# EAGLE design Pointcast_lower_board_V1.02 (EAGLE 7.5.0)
DESIGNER: Rob Oudendijk; VERSION: V1.02
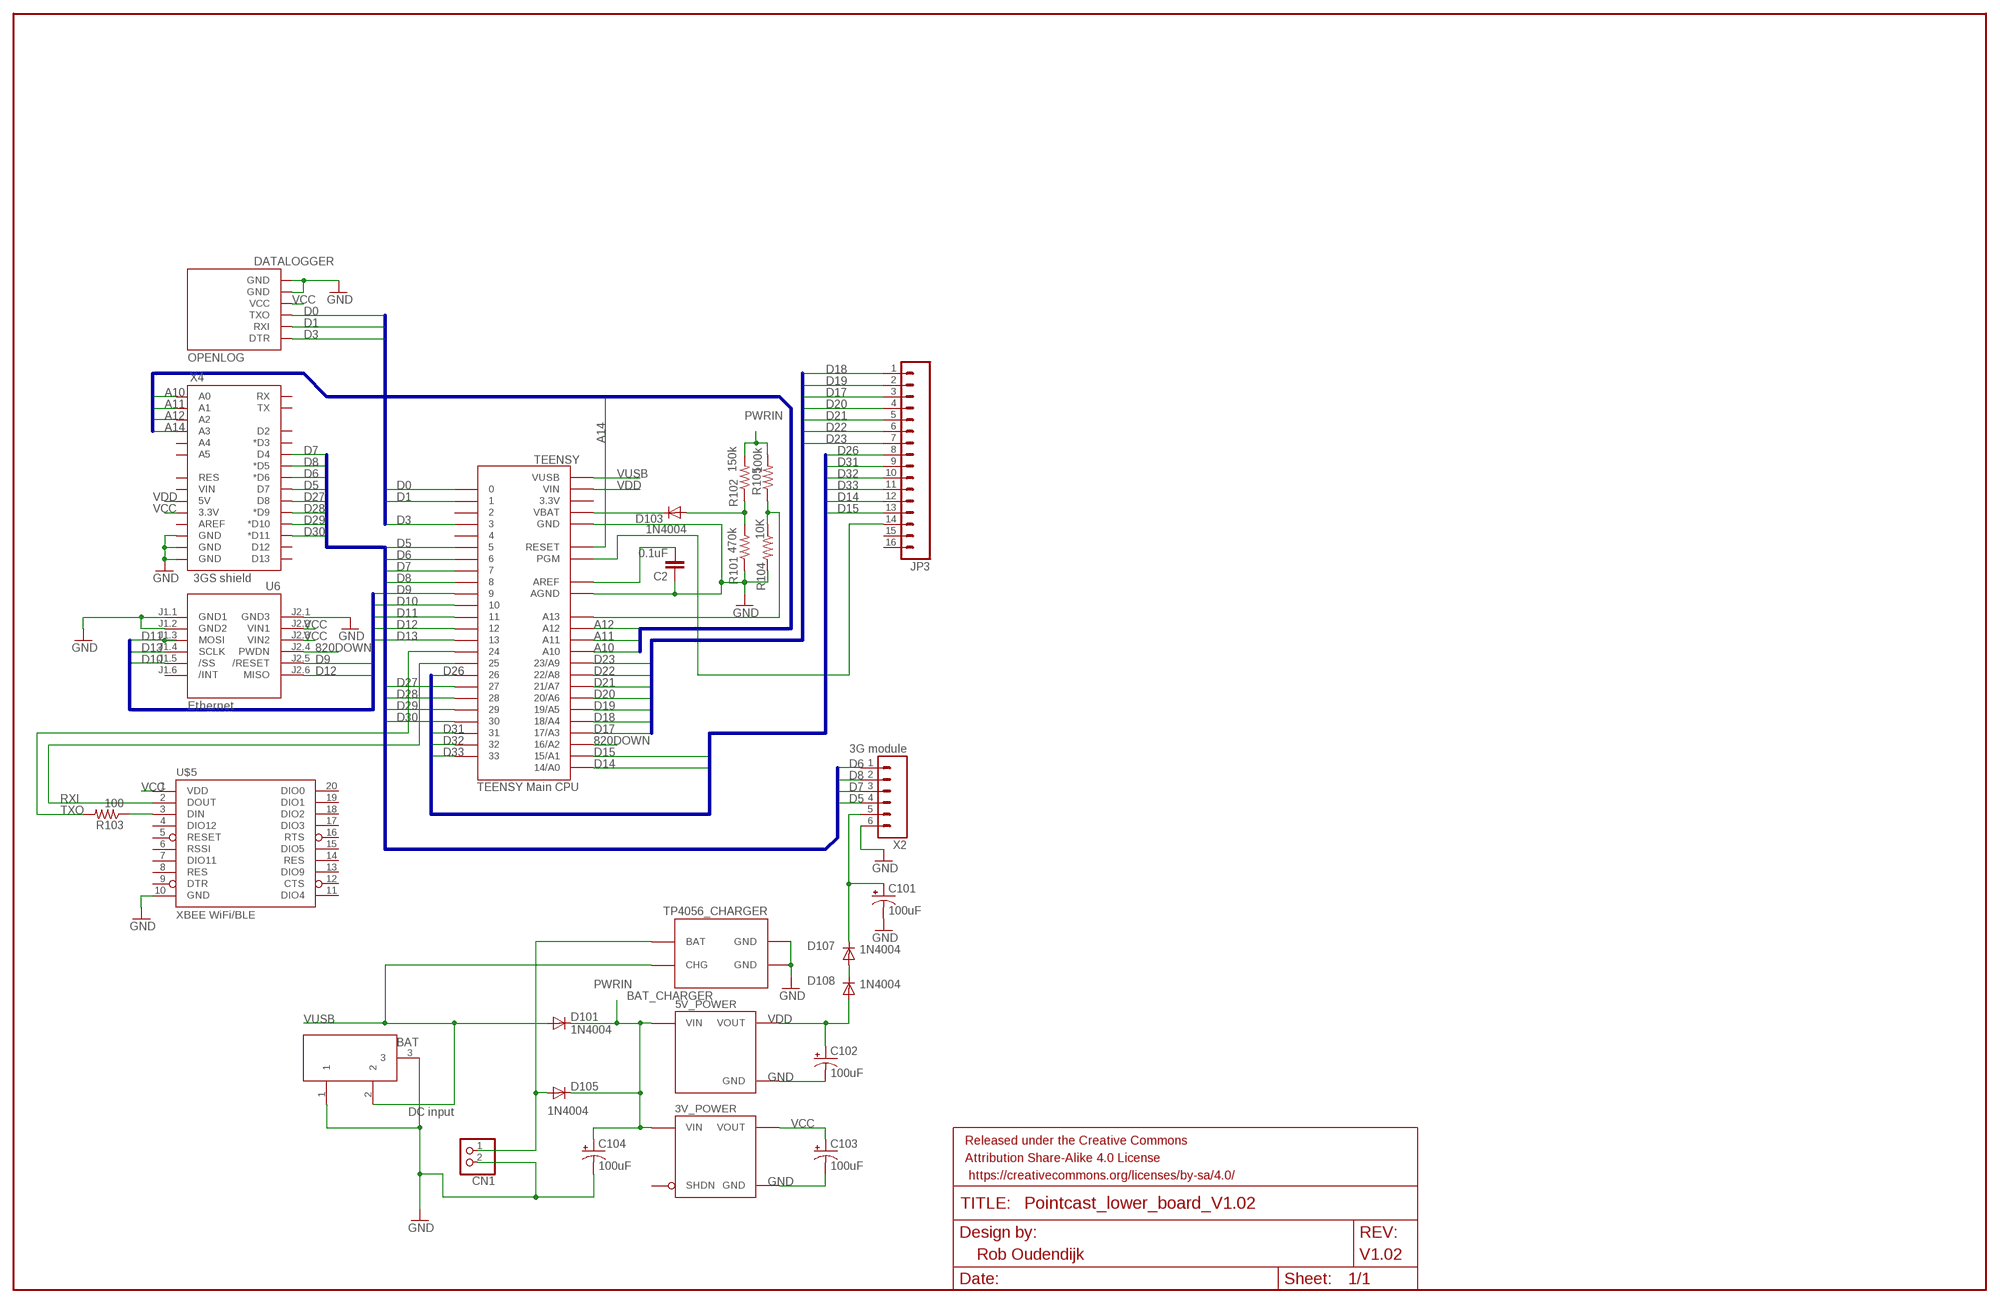
[diagram p0: schematic, sheet 1]

## Parts
3V_POWER  POLOLU_D24V3AXV  [POLOLU_D24VXAYV_HC]
5V_POWER  POLOLU_S7V8F5  [POLOLU_S7V8F5]
BAT_CHARGER  TP4056_CHARGER  [TP4056]
C2  0.1uF  C-EU025-024X044  [C025-024X044]
C101  100uF  CAP_POLPTH1  [CPOL-RADIAL-100UF-25V]
C102  100uF  CAP_POLPTH1  [CPOL-RADIAL-100UF-25V]
C103  100uF  CAP_POLPTH1  [CPOL-RADIAL-100UF-25V]
C104  100uF  CAP_POLPTH1  [CPOL-RADIAL-100UF-25V]
CN1  JST_2PIN-THM-RA  [JST-PH-2-THM-RA]
D101  1N4004  [DO41-10]
D103  1N4004  [DO41-10]
D105  1N4004  [DO41-10]
D107  1N4004  [DO41-10]
D108  1N4004  [DO41-10]
DATALOGGER  OPENLOG  [OPENLOG]
DCINPUT  5Volt  DC21MMX  [DC-21MM]
FRAME1  FRAME-LEDGER  [CREATIVE_COMMONS]
JP3  M16PTH  [1X16]
R101  470k  R-US_0207/10  [0207/10]
R102  150k  R-US_0207/10  [0207/10]
R103  100  R-US_0207/10  [0207/10]
R104  10K  R-US_0207/10  [0207/10]
R105  100k  R-US_0207/10  [0207/10]
TEENSY  TEENSY Main CPU  TEENSY_3.0_ALLPINS  [TEENSY_3.0_ALLPINS]
U6  Ethernet  WIZ820IO_DEVICE'DUAL-IN-LINE'  [WIZ820IO]
U$5  XBEE WiFi/BLE  XBEE-2B2  [XBEE-SILK]
X2  3G module  M06SILK_FEMALE_PTH  [1X06]
X4  3GS shield  ARDUINO_SHIELDLABEL  [DUEMILANOVE_SHIELD]

## Nets
820DOWN: TEENSY.16/A2 U6.J2.4(PWDN)
A10: TEENSY.A10 X4.A0
A11: TEENSY.A11 X4.A1
A12: TEENSY.A12 X4.A2
A14: TEENSY.RESET X4.A3
BAT [VDD]: BAT_CHARGER.BAT CN1.1 D105.A
D0: DATALOGGER.JP1$3(TXO) TEENSY.0
D1: DATALOGGER.JP1$2(RXI) TEENSY.1
D3: DATALOGGER.JP1$1(DTR) TEENSY.3
D5: TEENSY.5 X2.4 X4.D7
D6: TEENSY.6 X2.1 X4.D6(*D6)
D7: TEENSY.7 X2.3 X4.D4
D8: TEENSY.8 X2.2 X4.D5(*D5)
D9: TEENSY.9 U6.J2.5(/RESET)
D10: TEENSY.10 U6.J1.5(/SS)
D11: TEENSY.11 U6.J1.3(MOSI)
D12: TEENSY.12 U6.J2.6(MISO)
D13: TEENSY.13 U6.J1.4(SCLK)
D14: JP3.12 TEENSY.14/A0
D15: JP3.13 TEENSY.15/A1
D17: JP3.3 TEENSY.17/A3
D18: JP3.1 TEENSY.18/A4
D19: JP3.2 TEENSY.19/A5
D20: JP3.4 TEENSY.20/A6
D21: JP3.5 TEENSY.21/A7
D22: JP3.6 TEENSY.22/A8
D23: JP3.7 TEENSY.23/A9
D26: JP3.8 TEENSY.26
D27: TEENSY.27 X4.D8
D28: TEENSY.28 X4.D9(*D9)
D29: TEENSY.29 X4.D10(*D10)
D30: TEENSY.30 X4.D11(*D11)
D31: JP3.9 TEENSY.31
D32: JP3.10 TEENSY.32
D33: JP3.11 TEENSY.33
GND [VCC]: 3V_POWER.G(GND) 5V_POWER.G(GND) BAT_CHARGER.GND BAT_CHARGER.GND2(GND) C2.1 C101.1(-) C102.1(-) C103.1(-) C104.1(-) CN1.2 DATALOGGER.JP1$5(GND) DATALOGGER.JP1$6(GND) DCINPUT.1 DCINPUT.3 R101.1 R104.2 TEENSY.AGND TEENSY.GND TEENSY.GND1(GND) TEENSY.GND2(GND) U6.J1.1(GND1) U6.J1.2(GND2) U6.J2.1(GND3) U$5.10(GND) X2.6 X4.GND@0(GND) X4.GND@1(GND) X4.GND@2(GND)
N$1: D103.C TEENSY.VBAT
N$2: D103.A R101.2 R102.1
N$8: R104.1 R105.1 TEENSY.A13
N$10: R103.1 U$5.3(DIN)
N$21: C2.2 TEENSY.AREF
N$22: JP3.14 TEENSY.PGM
N$31 [VCC]: D107.A D108.C
N$32 [VCC]: C101.2(+) D107.C X2.5
PWRIN [VDD]: 3V_POWER.I(VIN) 5V_POWER.I(VIN) C104.2(+) D101.C D105.C R102.2 R105.2
RXI: TEENSY.25 U$5.2(DOUT)
TXO: R103.2 TEENSY.24
VCC [VCC]: 3V_POWER.O(VOUT) C103.2(+) DATALOGGER.JP1$4(VCC) U6.J2.2(VIN1) U6.J2.3(VIN2) U$5.1(VDD) X4.3.3V
VDD [VDD]: 5V_POWER.O(VOUT) C102.2(+) D108.A TEENSY.VIN X4.5V
VUSB [VDD]: BAT_CHARGER.CHARGER(CHG) D101.A DCINPUT.2 TEENSY.VUSB
Unconnected: 3V_POWER.S(SHDN) JP3.15 JP3.16 TEENSY.2 TEENSY.3.3V TEENSY.3.3V1(3.3V) TEENSY.3.3V2(3.3V) TEENSY.4 U6.J1.6(/INT) U$5.4(DIO12) U$5.5(RESET) U$5.6(RSSI) U$5.7(DIO11) U$5.8(RES) U$5.9(DTR) U$5.11(DIO4) U$5.12(CTS) U$5.13(DIO9) U$5.14(RES) U$5.15(DIO5) U$5.16(RTS) U$5.17(DIO3) U$5.18(DIO2) U$5.19(DIO1) U$5.20(DIO0) X4.A4 X4.A5 X4.AREF X4.D2 X4.D3(*D3) X4.D12 X4.D13 X4.RES X4.RX X4.TX X4.VIN

## Buses
D[17..23]
D[9..13]
D[0..3]
D[5..30]
A[10..14]
D[14..33]

## Notes on the sheet
- DC input

## Library data of the parts
3V_POWER = Pololu:POLOLU_D24V3A*V: Pololu Adjustable Step Down Voltage Regulators Series D24V3A_V (300 mA) 0.4"x0.6" SOURCE www.pololu.com/ PACKAGE THT; 4-pin (0.1"); 0.4"x0.6" TECHNOLOGIES D24V3A…V Vi = (4.5…42)V Vo/V (Vo < Vi) X: (generic) L: (2.5… 7.5) H: (4.0…25.0) Io: 300 mA; Quiescent Current: 2 mA (SHDN: 20 uA) Author: Dipl.-Ing. FH Rainer Bayer
5V_POWER = POLOLU1:POLOLU_S7V8F5: POLOLU_S7V8F5
BAT_CHARGER = open_hw_sockets:TP4056_CHARGER: TP4056
C2 = rcl:C-EU: CAPACITOR, European symbol
C101-C104 = SparkFun-Capacitors:CAP_POL: Capacitor Polarized These are standard SMD and PTH capacitors. Normally 10uF, 47uF, and 100uF in electrolytic and tantalum varieties. Always verify the external diameter of the through hole cap, it varies with capacity, voltage, and manufacturer. The EIA devices should be standard.
CN1 = adafruit:JST_2PIN: JST 2-Pin Connectors of various flavors SMT-RA (S2B-PH-SM4) 4UConnector #17311 SMT (B2B-PH-SM4) THM-RA (S2B-PH) THM (B2B-PH)
D101 D103 D105 D107 D108 = adafruit:1N4004: DIODE General purpose 1N400x type rectifier (With bigger pads) http://www.ladyada.net/library/pcb/eaglelibrary.html
DATALOGGER = open_hw_sockets:OPENLOG: Openlog
DCINPUT = powersupply:DC21MM
FRAME1 = SparkFun-Aesthetics:FRAME-LEDGER: Schematic Frame Standard 11x14 US Ledger frame
JP3 = SparkFun-Connectors:M16: 1x16 .1" header
R101-R105 = adafruit:R-US_: RESISTOR, American symbol
TEENSY = Teensy3.0:TEENSY_3.0_ALLPINS: Teensy 3.0 with all pin holes and optional SMD-mount unshrouded header on bottom of Teensy 3.0. For more basic versions, see 'Basic', '+4' and 'AllAnalogPins'. Requires the installation of a un-shrouded SMD header on the underside of the Teensy 3.0
U6 = Wiz820io:WIZ820IO_DEVICE: WIZnet, WIZ820io plug in module incl. W5200 chip and MagJack
U$5 = SparkFun-RF:XBEE-2: Xbee module footprints SMT header is CONN-09042.
X2 = SparkFun-Connectors:M06: Header 6 Standard 6-pin 0.1" header. Use with straight break away headers (SKU : PRT-00116), right angle break away headers (PRT-00553), swiss pins (PRT-00743), machine pins (PRT-00117), and female headers (PRT-00115). Molex polarized connector foot print use with SKU : PRT-08094 with associated crimp pins and housings. NOTES ON THE VARIANTS LOCK and LOCK_LONGPADS... This footprint was designed to help hold the alignment of a through-hole component (i.e. 6-pin header) while soldering it into place. You may notice that each hole has been shifted either up or down by 0.005 of an inch from it's more standard position (which is a perfectly straight line). This slight alteration caused the pins (the squares in the middle) to touch the edges of the holes. Because they are alternating, it causes a "brace" to hold the component in place. 0.005 has proven to be the perfect amount of "off-center" position when using our standard breakaway headers. Although looks a little odd when you look at the bare footprint, once you have a header in there, the alteration is very hard to notice. Also,if you push a header all the way into place, it is covered up entirely on the bottom side. This idea of altering the position of holes to aid alignment will be further integrated into the Sparkfun Library for other footprints. It can help hold any component with 3 or more connection pins.; PROD_ID: CONN-08437
X4 = SparkFun-Boards:ARDUINO_SHIELD: Arduino shield footprint

## Net classes
0 default: width 0.406 mm, drill 0.254 mm, clearance 0.305 mm
1 VCC: width 0.7 mm, drill 0.254 mm, clearance 0.305 mm to class 0, clearance 0.205 mm
2 GND: width 0.7 mm, drill 0.254 mm, clearance 0.305 mm to class 0, clearance 0.205 mm to class 1
3 VDD: width 0.7 mm, drill 0.254 mm, clearance 0.305 mm to class 0, clearance 0.205 mm to class 1

## Board
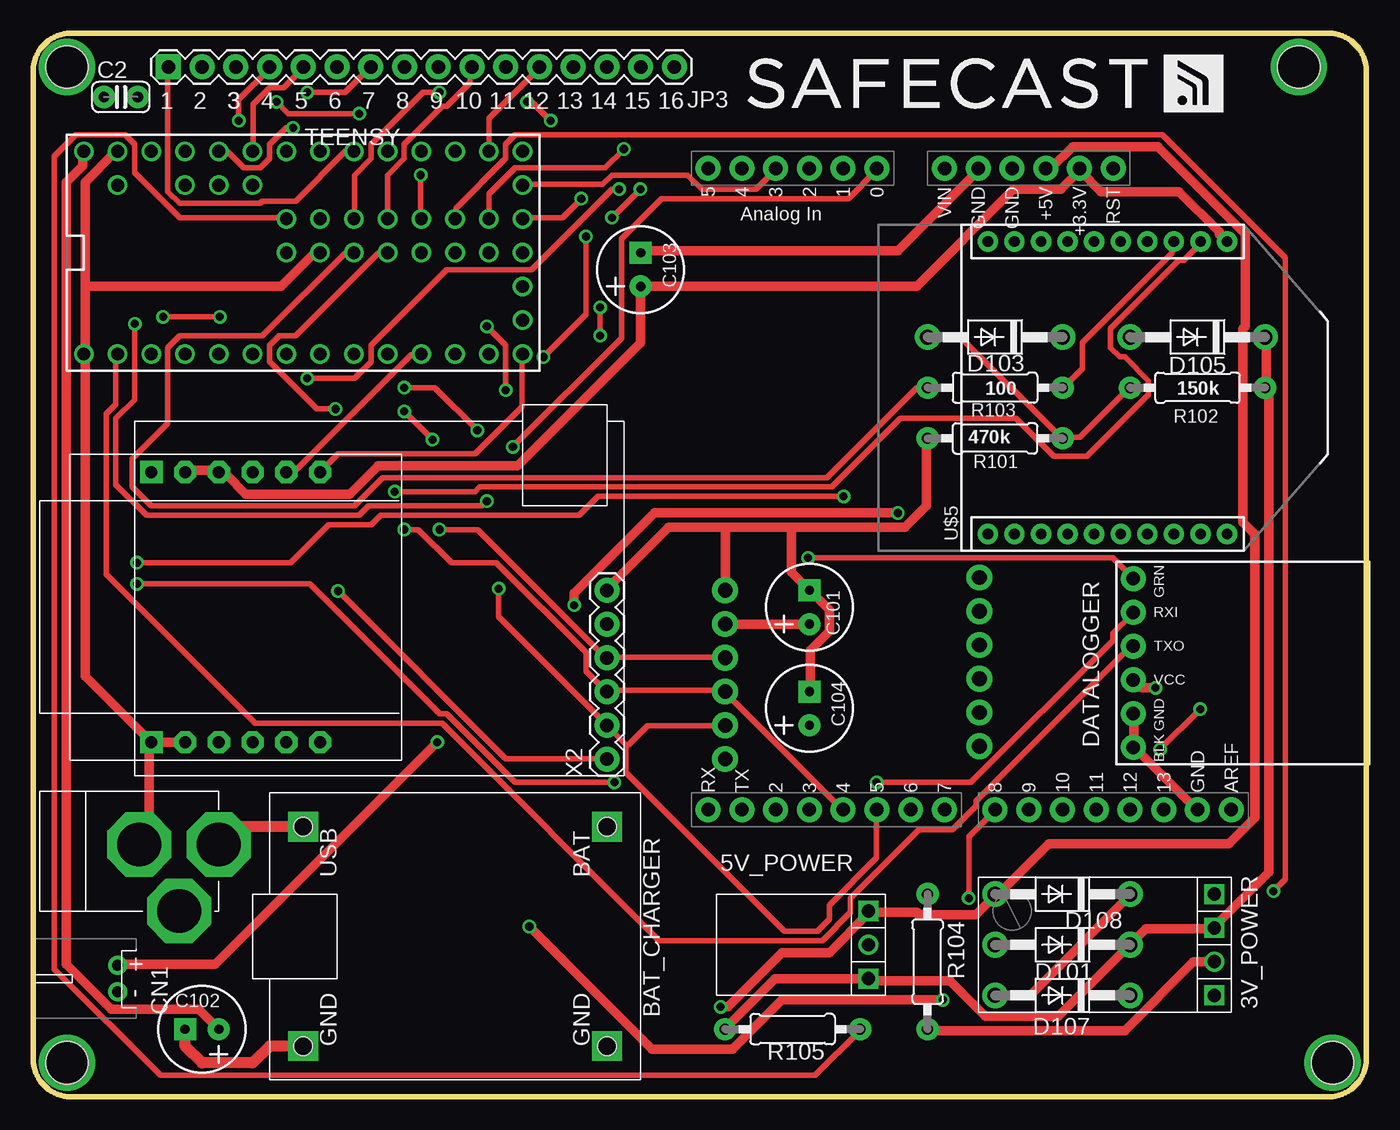
[diagram p1: board, top side]
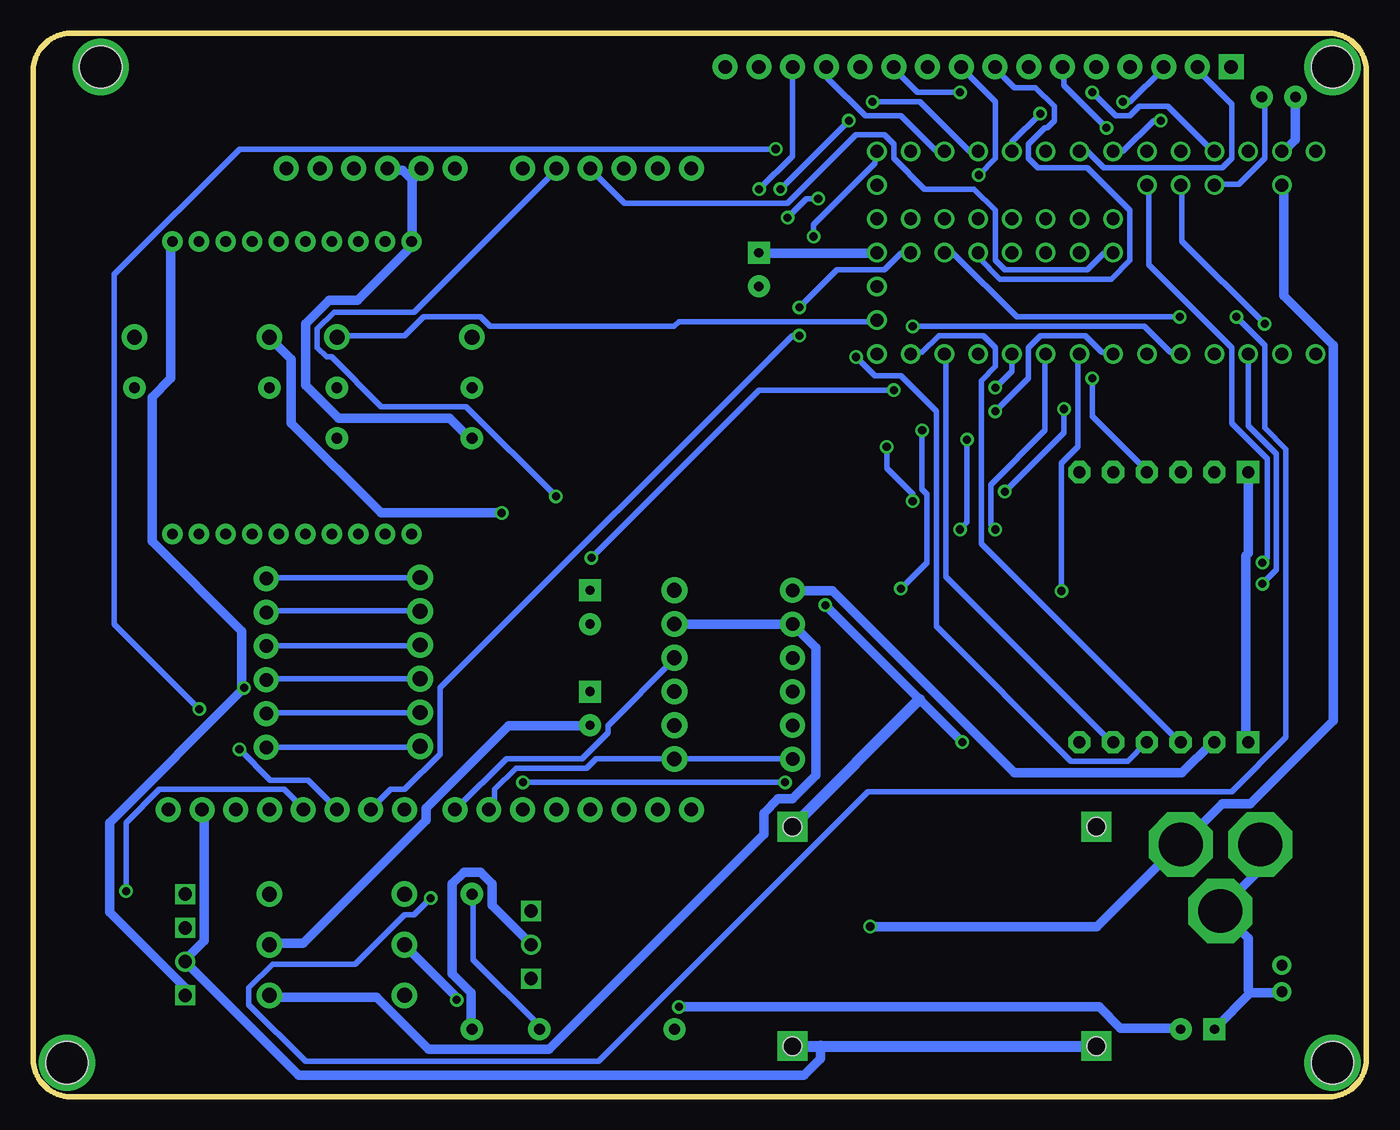
[diagram p2: board, bottom side, seen from below]

Size 100.33 x 80.01 mm. Coordinates in mm from the lower left corner, seen from the top.
Outline: 97.49,0 2.84,0 arc-90 0,2.84 0,77.17 arc-90 2.84,80.01 97.49,80.01 arc-90 100.33,77.17 100.33,2.84 arc-90 97.49,0
Copper layers (1*16): Top 0.035mm / dielectric 1.5mm / Bottom 0.035mm
Design rules "default": minimum track width 10mil, minimum drill 24mil, track to track 8mil, track to pad 8mil, pad to pad 8mil, via to via 8mil, smd to smd 8mil, copper to edge 40mil, drill to drill 8mil, minimum pad ring 10mil, minimum via ring 8mil, stop-mask expansion 4mil, vias tented up to drill 0mil, thermal gap 10mil
Holes 3.2 mm at 95.25,77.47 97.79,2.54 2.54,2.54 2.54,77.47

### Footprints (pad centres in the part's own frame; a part is rotated, then mirrored left to right if it is on the bottom)
POLOLU_D24VXAYV_HC = drill 1: G -1.27,-8.89 | drill 1 square: I 1.27,-8.89; O -3.81,-8.89; S 3.81,-8.89
POLOLU_S7V8F5 = drill 1: G 0,-5.715 | drill 1 square: I -2.54,-5.715; O 2.54,-5.715
TP4056 = drill 1.5 square: BAT 7.62,-12.7; CHARGER 7.62,10.16; GND -8.89,10.16; GND2 -8.89,-12.7 | hole 1.4: -8.89,10.16; 7.62,10.16; 7.62,-12.7; -8.89,-12.7
C025-024X044 = drill 0.813 pad 1.676: 1 -1.27,0; 2 1.27,0
CPOL-RADIAL-100UF-25V = drill 0.7 pad 1.651 square: 1 -1.27,0 | drill 0.7 pad 1.651: 2 1.27,0
JST-PH-2-THM-RA = drill 0.8 pad 1.422: 1 1,0; 2 -1,0
DO41-10 = drill 1.118 pad 1.93: A 5.08,0; C -5.08,0
OPENLOG = drill 1.016 pad 1.88: JP1$1 1.27,1.27; JP1$2 3.81,1.27; JP1$3 6.35,1.27; JP1$4 8.89,1.27; JP1$5 11.43,1.27; JP1$6 13.97,1.27
DC-21MM = drill 3.302 pad 4.826 octagon: 1 -5.08,-3.353; 2 -0.076,-6.35; 3 -0.076,-0.356
1X16 = drill 1.016 pad 1.88 square: 1 0,0 | drill 1.016 pad 1.88: 2 2.54,0; 3 5.08,0; 4 7.62,0; 5 10.16,0; 6 12.7,0; 7 15.24,0; 8 17.78,0; 9 20.32,0; 10 22.86,0; 11 25.4,0; 12 27.94,0; 13 30.48,0; 14 33.02,0; 15 35.56,0; 16 38.1,0
0207/10 = drill 0.813 pad 1.676: 1 -5.08,0; 2 5.08,0
TEENSY_3.0_ALLPINS = drill 0.965: 0 -7.62,13.97; 1 -7.62,11.43; 2 -7.62,8.89; 3 -7.62,6.35; 3.3V 7.62,11.43; 3.3V1 -2.54,-16.51; 3.3V2 2.54,-1.27; 4 -7.62,3.81; 5 -7.62,1.27; 6 -7.62,-1.27; 7 -7.62,-3.81; 8 -7.62,-6.35; 9 -7.62,-8.89; 10 -7.62,-11.43; 11 -7.62,-13.97; 12 -7.62,-16.51; 13 7.62,-16.51; 14/A0 7.62,-13.97; 15/A1 7.62,-11.43; 16/A2 7.62,-8.89; 17/A3 7.62,-6.35; 18/A4 7.62,-3.81; 19/A5 7.62,-1.27; 20/A6 7.62,1.27; 21/A7 7.62,3.81; 22/A8 7.62,6.35; 23/A9 7.62,8.89; 24 0,-3.81; 25 0,-6.35; 26 0,-8.89; 27 0,-11.43; 28 0,-13.97; 29 2.54,-13.97; 30 2.54,-11.43; 31 2.54,-8.89; 32 2.54,-6.35; 33 2.54,-3.81; A10 5.08,6.35; A11 5.08,3.81; A12 0,1.27; A13 2.54,1.27; AGND 7.62,13.97; AREF 5.08,8.89; GND -7.62,16.51; GND1 0,-16.51; GND2 0,-1.27; PGM 2.54,-16.51; RESET 5.08,-16.51; VBAT -5.08,-16.51; VIN 7.62,16.51; VUSB 5.08,13.97
WIZ820IO = drill 0.9 pad 1.676 square: J1.1 -10.16,6.35; J2.1 10.16,6.35 | drill 0.9 pad 1.676 octagon: J1.2 -10.16,3.81; J1.3 -10.16,1.27; J1.4 -10.16,-1.27; J1.5 -10.16,-3.81; J1.6 -10.16,-6.35; J2.2 10.16,3.81; J2.3 10.16,1.27; J2.4 10.16,-1.27; J2.5 10.16,-3.81; J2.6 10.16,-6.35
XBEE-SILK = drill 0.8 pad 1.524: 1 -11,20; 2 -11,18; 3 -11,16; 4 -11,14; 5 -11,12; 6 -11,10; 7 -11,8; 8 -11,6; 9 -11,4; 10 -11,2; 11 11,2; 12 11,4; 13 11,6; 14 11,8; 15 11,10; 16 11,12; 17 11,14; 18 11,16; 19 11,18; 20 11,20
1X06 = drill 1.016 pad 1.88: 1 0,0; 2 2.54,0; 3 5.08,0; 4 7.62,0; 5 10.16,0; 6 12.7,0
DUEMILANOVE_SHIELD = drill 1.016 pad 1.88: 3.3V 12.7,27.94; 5V 10.16,27.94; A0 -2.54,27.94; A1 -5.08,27.94; A2 -7.62,27.94; A3 -10.16,27.94; A4 -12.7,27.94; A5 -15.24,27.94; AREF 24.13,-20.32; D2 -10.16,-20.32; D3 -7.62,-20.32; D4 -5.08,-20.32; D5 -2.54,-20.32; D6 0,-20.32; D7 2.54,-20.32; D8 6.35,-20.32; D9 8.89,-20.32; D10 11.43,-20.32; D11 13.97,-20.32; D12 16.51,-20.32; D13 19.05,-20.32; GND@0 7.62,27.94; GND@1 5.08,27.94; GND@2 21.59,-20.32; RES 15.24,27.94; RX -15.24,-20.32; TX -12.7,-20.32; VIN 2.54,27.94

### Placement (x,y rotation side)
3V_POWER  80.01,11.43 90 top
5V_POWER  57.15,11.43 90 top
BAT_CHARGER  30.48,12.7 90 top
C2  6.59,75.22 0 top
C101  58.42,36.83 270 top
C102  12.7,5.08 0 top
C103  45.72,62.23 270 top
C104  58.42,29.21 270 top
CN1  6.35,8.89 90 top
D101  77.47,11.43 180 top
D103  72.39,57.15 180 top
D105  87.63,57.15 180 top
D107  77.47,7.62 180 top
D108  77.47,15.24 180 top
DATALOGGER  81.52,40.26 270 top
DCINPUT  7.62,19.05 90 top
FRAME1  71.12,66.67 0 top
JP3  10.16,77.47 0 top
R101  72.39,49.53 0 top
R102  87.63,53.34 0 top
R103  72.39,53.34 180 top
R104  67.31,10.16 270 top
R105  57.15,5.08 180 top
TEENSY  20.32,63.5 90 top
U6  15.24,36.83 90 top
U$5  69.85,53.34 270 top
U$10  [SAFECAST_LOGO1]  53.34,73.66 0 top
X2  43.18,25.4 90 top
X4  66.04,41.91 0 top

### Tracks (layer width: path | path; a pad name or v marks a point on that pad's centre or on a via)
820DOWN  (via drill 0.61)
  Top 0.406: v37.16,74.85 37.52,74.85 v38.94,73.43 | v44.09,68.28 43.56,68.28 37.52,62.23 31.11,62.23 25.43,56.54 25.43,55.3 24.18,54.05 v20.62,54.05
  Bottom 0.406: TEENSY.16/A2 29.87,71.12 33.6,74.85 v37.16,74.85 | v44.09,68.28 v38.94,73.43 | v20.62,54.05 20.62,51.21 16.54,47.12 U6.J2.4
A10  (via drill 0.61)
  Top 0.406: v7.64,58.14 7.64,52.45 6.22,51.03 6.22,46.05 8.53,43.74 24.54,43.74 25.25,44.45 33.78,44.45 v34.14,44.81 | v36.09,48.9 44.27,57.07 44.27,64.54 47.3,67.56 61.34,67.56 63.48,69.7 X4.A0
  Bottom 0.406: v7.64,58.14 13.87,64.36 13.87,68.45 TEENSY.A10 | v34.14,44.81 34.14,45.34 36.09,47.3 v36.09,48.9
A11  (via drill 0.61)
  Top 0.406: v7.82,40.18 19.38,40.18 22.23,43.03 25.43,43.03 26.14,43.74 41.07,43.74 42.49,45.16 v60.98,45.16
  Bottom 0.406: v7.82,40.18 7.47,40.54 7.47,48.01 10.13,50.67 10.13,56.36 16.36,62.59 16.36,68.45 TEENSY.A11 | v60.98,45.16 67.74,51.92 74.14,51.92 77.88,55.65 78.23,55.65 78.94,56.36 78.94,57.78 77.7,59.03 71.65,59.03 60.98,69.7 60.98,69.88 X4.A1
A12
  Bottom 0.406: TEENSY.A12 19.2,63.48 19.74,63.48 20.98,62.23 27.2,62.23 27.91,62.94 27.91,66.67 29.52,68.28 33.25,68.28 35.56,70.59 35.56,71.65 36.27,72.36 38.41,72.36 43.56,67.21 55.83,67.21 58.32,69.7 X4.A2
A14
  Top 0.406: TEENSY.RESET 36.98,68.63 42.85,68.63 43.56,69.34 49.25,69.34 50.32,68.28 54.41,68.28 55.83,69.7 X4.A3
BAT  (via drill 0.61)
  Top 0.7: v30.4,26.67 13.69,9.96 6.4,9.96 CN1.1 | v40.72,36.98 40.72,37.87 46.76,43.92 v65.08,43.92
  Bottom 0.7: v40.72,36.98 33.62,29.88 v30.4,26.67 | v65.08,43.92 74.14,43.92 80.9,50.67 80.9,55.47 82.5,57.07 D105.A
  Bottom 0.813: BAT_CHARGER.BAT 33.62,29.88
D0
  Top 0.406: TEENSY.0 6.22,55.83 6.22,52.09 5.51,51.38 5.51,39.29 16.71,28.09 30.76,28.09 47.12,11.73 59.38,11.73 61.52,13.87 61.52,14.94 66.67,20.09 69.16,20.09 70.94,21.87 70.94,22.23 82.68,33.96 DATALOGGER.JP1$3
D1  (via drill 0.61)
  Top 0.406: v7.82,38.58 20.8,38.58 30.58,28.8 31.11,28.8 36.27,23.65 v43.74,23.65 | v63.48,23.65 70.59,23.65 81.25,34.31 81.25,34.85 82.68,36.27 DATALOGGER.JP1$2
  Bottom 0.406: TEENSY.1 8.89,50.49 6.76,48.36 6.76,39.65 v7.82,38.58 | v63.48,23.65 v43.74,23.65
D3  (via drill 0.61)
  Top 0.406: v34.14,57.96 35.56,56.54 v35.56,53.16 | v58.32,40.54 81.25,40.54 82.68,39.12 DATALOGGER.JP1$1
  Bottom 0.406: v34.14,57.96 16.71,57.96 14.76,56.01 14.05,56.01 TEENSY.3 | v35.56,53.16 45.7,53.16 v58.32,40.54
D5  (via drill 0.61, 1.1 pad 1.93)
  Top 0.406: v30.05,49.43 v27.91,51.56 | v30.58,42.67 33.43,42.67 43.03,33.07 X2.4 43.2,33.07 51.92,33.07 v52.07,33.02
  Bottom 0.406: v27.91,51.56 25.43,54.05 25.43,56.36 24.54,57.25 21.16,57.25 19.91,56.01 19.2,56.01 TEENSY.5 | v30.05,49.43 30.05,43.2 v30.58,42.67 | v52.07,33.02 52.09,32.89 57.07,27.91 57.07,27.38 59.03,25.43 64.72,25.43 68.45,21.69 X4.D7
D6  (via drill 0.61, 1.1 pad 1.93)
  Top 0.406: v22.94,38.05 35.56,25.43 43.03,25.43 X2.1
  Bottom 0.406: v22.94,38.05 22.94,47.65 21.69,48.9 21.69,55.83 TEENSY.6 | 65.61,21.69 65.96,21.69 X4.D6 65.61,21.87 65.61,23.11 64.01,24.71 58.67,24.71 57.96,25.43 52.27,25.43 v52.07,25.4 51.92,25.43 43.2,25.43 X2.1
D7  (via drill 0.61, 1.1 pad 1.93)
  Top 0.406: v27.91,42.67 28.98,42.67 31.47,40.18 34.85,40.18 41.6,33.43 41.6,32 43.03,30.58 X2.3 43.2,30.58 51.92,30.58 v52.07,30.48 52.09,30.4 60.81,21.69 X4.D4
  Bottom 0.406: v27.91,42.67 28.27,43.03 28.27,46.05 24.18,50.14 24.18,55.83 TEENSY.7
D8  (via drill 0.61, 1.1 pad 1.93)
  Top 0.406: v27.91,53.34 30.23,53.34 v33.43,50.14 | v35.03,38.23 35.03,36.09 X2.2 44.63,26.49 | 44.63,26.49 44.63,24.36 56.54,12.45 59.03,12.45 59.92,13.34 59.92,14.4 63.48,17.96 63.48,21.51 X4.D5 | v52.07,27.94 51.92,27.91 46.23,27.91 44.81,26.49 44.63,26.49
  Bottom 0.406: TEENSY.8 26.67,54.59 v27.91,53.34 | v33.43,50.14 33.43,45.7 33.07,45.34 33.07,40.18 v35.03,38.23
D9
  Top 0.406: TEENSY.9 29.16,55.83 28.45,55.83 19.74,47.12 19.2,47.12 U6.J2.5
D10
  Bottom 0.406: TEENSY.10 31.65,55.83 31.65,39.12 19.2,26.67 U6.J1.5
D11
  Bottom 0.406: TEENSY.11 34.14,56.01 33.43,56.01 32.18,57.25 28.8,57.25 27.91,56.36 27.91,54.94 28.98,53.87 28.98,41.6 14.05,26.67 U6.J1.3
D12
  Top 0.406: TEENSY.12 36.8,55.83 36.8,51.92 33.25,48.36 22.94,48.36 21.69,47.12 U6.J2.6
D13  (via drill 0.61)
  Top 0.406: v41.6,64.72 41.6,58.85 v38.41,55.65
  Bottom 0.406: v41.6,64.72 41.6,65.61 36.98,70.23 36.98,71.12 TEENSY.13 | v38.41,55.65 36.98,54.23 35.03,54.23 32.36,51.56 32.36,35.38 22.23,25.25 17.96,25.25 16.54,26.67 U6.J1.4
D14
  Top 0.406: TEENSY.14/A0 34.31,71.12 34.31,73.61 38.05,77.34 JP3.12
D15
  Bottom 0.406: TEENSY.15/A1 32.36,71.12 35.03,73.79 37.69,73.79 40.54,76.63 40.54,77.34 JP3.13
D17  (via drill 0.61)
  Top 0.406: v24.54,73.97 19.2,73.97 v18.31,74.85
  Bottom 0.406: TEENSY.17/A3 26.67,71.83 v24.54,73.97 | v18.31,74.85 17.78,74.85 15.29,77.34 JP3.3
D18
  Top 0.406: TEENSY.18/A4 23.47,71.12 19.74,67.39 17.25,67.39 17.07,67.21 11.02,67.21 10.13,68.1 10.13,77.34 JP3.1
D19
  Bottom 0.406: TEENSY.19/A5 20.98,71.12 19.74,69.88 10.85,69.88 10.13,70.59 10.13,74.68 12.8,77.34 JP3.2
D20  (via drill 0.61)
  Top 0.406: v15.47,73.43 15.47,75.03 17.78,77.34 JP3.4
  Bottom 0.406: TEENSY.20/A6 18.31,71.12 16,73.43 v15.47,73.43
D21
  Top 0.406: TEENSY.21/A7 16.54,71.12 16.54,74.68 17.78,75.92 18.85,75.92 20.27,77.34 JP3.5
D22  (via drill 0.61)
  Top 0.406: TEENSY.22/A8 14.58,71.12 15.82,69.88 17.07,69.88 17.78,70.59 17.78,71.65 19.02,72.9 v19.56,72.9
  Bottom 0.406: v19.56,72.9 22.76,76.1 22.76,77.34 JP3.6
D23  (via drill 0.61)
  Top 0.406: v20.62,75.56 23.47,75.56 25.25,77.34 JP3.7
  Bottom 0.406: v20.62,75.56 18.85,73.79 17.78,73.79 17.07,74.5 14.94,74.5 11.56,71.12 TEENSY.23/A9
D26
  Bottom 0.406: TEENSY.26 29.16,63.48 29.16,63.12 27.56,61.52 19.2,61.52 17.78,62.94 17.78,66.67 20.98,69.88 24.71,69.88 25.43,70.59 25.43,71.65 24.18,72.9 24,72.9 23.47,73.43 23.47,74.5 24.89,75.92 26.49,75.92 27.91,77.34 JP3.8
D27  (via drill 0.61)
  Top 0.406: v9.78,58.67 v14.05,58.67 | v70.41,14.94 70.41,19.56 72.36,21.51 X4.D8
  Bottom 0.406: v14.05,58.67 26.31,58.67 31.11,63.48 31.65,63.48 TEENSY.27 | v9.78,58.67 7.64,56.54 7.64,50.32 6.04,48.72 6.04,27.03 10.13,22.94 37.52,22.94 57.78,2.67 79.83,2.67 84.1,6.93 84.1,8.18 82.32,9.96 76.1,9.96 72.36,13.69 71.65,13.69 v70.41,14.94
D28  (via drill 0.61)
  Top 0.406: v42.67,57.25 v42.67,59.38
  Bottom 0.406: v42.67,59.38 39.83,62.23 36.27,62.23 35.03,63.48 34.31,63.48 TEENSY.28 | v42.67,57.25 43.2,57.25 69.7,30.76 69.7,25.78 72.36,23.11 73.43,23.11 74.85,21.69 X4.D9
D29  (via drill 0.61)
  Top 0.406: v44.45,71.3 43.03,69.88 36.27,69.88 34.31,67.92 34.31,66.14 TEENSY.29 | v84.81,26.14 v87.83,29.16
  Bottom 0.406: 77.34,21.69 X4.D10 77.52,21.69 79.65,23.82 82.5,23.82 v84.81,26.14 | v44.45,71.3 84.81,71.3 94.23,61.87 94.23,35.56 v87.83,29.16
D30  (via drill 0.61)
  Top 0.406: v93.34,15.47 94.23,16.36 94.23,63.12 84.99,72.36 36.27,72.36 35.56,71.65 35.56,70.59 31.83,66.85 31.83,66.14 TEENSY.30
  Bottom 0.406: v93.34,15.47 93.34,20.62 90.86,23.11 81.43,23.11 80.01,21.69 X4.D11
D31  (via drill 0.61)
  Top 0.406: v29.16,69.34 29.16,66.14 TEENSY.31
  Bottom 0.406: v29.16,69.34 27.91,70.59 27.91,74.85 30.4,77.34 JP3.9
D32
  Top 0.406: TEENSY.32 26.67,69.34 27.91,70.59 27.91,71.65 30.76,74.5 31.11,74.5 32.89,76.28 32.89,77.34 JP3.10
D33  (via drill 0.61)
  Top 0.406: v30.58,75.56 29.34,75.56 25.43,71.65 25.43,70.59 24.18,69.34 24.18,66.14 TEENSY.33
  Bottom 0.406: v30.58,75.56 33.78,75.56 35.56,77.34 JP3.11
GND  (via drill 1.1 pad 1.93)
  Top 0.7: 3.91,60.98 3.91,68.81 6.22,71.12 TEENSY.AGND | 3.91,60.98 3.91,56.01 TEENSY.GND 3.91,55.65 3.91,31.65 U6.J1.1 | 3.91,60.98 18.67,60.98 21.16,63.48 21.51,63.48 TEENSY.GND2 | U6.J1.2 U6.J1.1 | U6.J1.1 8.71,26.49 8.71,19.74 8,19.02 DCINPUT.3 | C103.1 45.87,63.65 65.08,63.65 71.12,69.7 X4.GND@1 | 87.48,21.69 X4.GND@2 87.3,21.87 83.03,26.14 DATALOGGER.JP1$6 82.86,26.31 82.86,28.8 DATALOGGER.JP1$5 | 57.07,42.85 65.61,42.85 67.21,44.45 67.21,49.43 R101.1 | 57.07,42.85 52.09,42.85 | 52.09,42.85 47.83,42.85 43.2,38.23 X2.6 | 52.09,42.85 52.09,38.23 v52.07,38.1 | 57.07,42.85 57.07,39.47 58.32,38.23 C101.1 58.67,37.87 59.92,36.63 59.92,35.03 58.5,33.6 58.5,30.58 C104.1 | 3V_POWER.G 88.9,10.13 87.3,10.13 82.14,4.98 67.39,4.98 R104.2
  Top 0.813: BAT_CHARGER.GND 17.78,3.81 16.51,2.54 12.7,2.54 11.43,3.81 C102.1
  Bottom 0.7: 8.71,7.82 6.4,7.82 CN1.2 | 8.71,7.82 11.38,5.16 C102.1 | 8.71,7.82 8.89,8 8.89,11.91 10.85,13.87 DCINPUT.1 10.85,14.22 8,17.07 8,18.85 DCINPUT.3 | TEENSY.GND1 36.98,63.48 45.7,63.48 C103.1 | 71.83,68.99 71.83,64.36 U$5.10 71.83,64.01 75.92,59.92 78.05,59.92 79.83,58.14 79.83,53.52 77.34,51.03 68.99,51.03 67.56,49.61 R101.1 | 71.83,68.99 71.12,69.7 X4.GND@1 | 71.83,68.99 72.54,69.7 73.61,69.7 X4.GND@0 | X4.GND@2 87.48,21.51 87.48,11.73 88.9,10.31 3V_POWER.G 88.72,9.96 80.37,1.6 42.32,1.6 41.07,2.85 41.07,3.81 | 5V_POWER.G 62.94,11.56 65.79,14.4 65.79,16 66.67,16.89 67.92,16.89 68.81,16 68.81,9.25 67.39,7.82 67.39,5.16 R104.2 | U6.J2.1 8.89,40.89 9.07,40.72 9.07,26.85 U6.J1.1 | U6.J1.2 11.56,26.67 13.87,24.36 26.49,24.36 40.18,38.05 43.03,38.05 X2.6 | C2.1 5.33,75.21 5.33,72.01 6.22,71.12 TEENSY.AGND
  Bottom 0.813: BAT_CHARGER.GND2 41.07,3.81 BAT_CHARGER.GND
N$1
  Bottom 0.406: TEENSY.VBAT 36.98,58.32 51.74,58.32 52.09,57.96 65.96,57.96 66.67,58.67 70.94,58.67 72.36,57.25 77.34,57.25 D103.C
N$2
  Top 0.406: R102.1 82.5,53.34 78.77,49.61 77.52,49.61 R101.2 77.34,49.61 69.88,57.07 67.39,57.07 D103.A
N$3  (via drill 1.1 pad 1.93)
  other vias: 71.21,39.06
N$4  (via drill 3.2 pad 3.81)
  other vias: 2.54,77.47
N$5  (via drill 3.2 pad 3.81)
  other vias: 95.25,77.47
N$6  (via drill 3.2 pad 3.81)
  other vias: 2.54,2.54
N$7  (via drill 3.2 pad 3.81)
  other vias: 97.79,2.54
N$8
  Top 0.406: TEENSY.A13 19.02,66.14 11.02,66.14 7.64,69.52 7.64,71.65 6.93,72.36 3.2,72.36 1.6,70.76 1.6,9.6 9.6,1.6 58.85,1.6 62.23,4.98 R105.1
  Bottom 0.406: R104.1 67.21,15.11 67.21,10.31 62.23,5.33 R105.1
N$9  (via drill 1.1 pad 1.93)
  other vias: 71.21,36.52
N$10
  Top 0.406: U$5.3 85.7,64.19 85.7,63.48 78.94,56.72 78.94,54.76 77.52,53.34 R103.1
N$11  (via drill 1.1 pad 1.93)
  other vias: 71.21,33.98
N$12  (via drill 1.1 pad 1.93)
  other vias: 71.21,31.44
N$13  (via drill 1.1 pad 1.93)
  other vias: 71.21,28.9
N$14  (via drill 1.1 pad 1.93)
  other vias: 71.21,26.36
N$15
  Bottom 0.406: 71.28,39.03 82.87,39.03
N$16
  Bottom 0.406: 71.28,36.58 82.82,36.58 82.82,36.53
N$17
  Bottom 0.406: 71.24,33.93 82.97,33.93 82.97,33.79
N$18
  Bottom 0.406: 71.28,31.43 82.97,31.43 82.97,31.29
N$19
  Bottom 0.406: 71.33,28.89 82.55,28.89 82.55,29.21
N$20
  Bottom 0.406: 71.24,26.29 82.82,26.29
N$21
  Bottom 0.406: TEENSY.AREF 11.38,68.63 9.6,68.63 7.64,70.59 7.64,75.03 7.82,75.21 C2.2
N$22  (via drill 0.61)
  Top 0.406: v41.25,67.56 39.83,66.14 36.98,66.14 TEENSY.PGM | v45.7,68.28 v43.56,66.14
  Bottom 0.406: v41.25,67.56 42.14,67.56 v43.56,66.14 | v45.7,68.28 43.2,70.76 43.2,77.34 JP3.14
N$31
  Top 0.7: D107.A 72.54,7.64 75.03,7.64 82.5,15.11 D108.C
N$32  (via drill 1.1 pad 1.93)
  Top 0.7: C101.2 v52.07,35.56
  Bottom 0.7: D107.C 82.5,7.47 74.5,7.47 70.59,3.56 61.52,3.56 45.34,19.74 45.34,21.34 44.27,22.4 43.2,22.4 41.43,24.18 41.43,33.78 43.03,35.38 X2.5 v52.07,35.56
PWRIN
  Top 0.7: R105.2 52.09,5.16 55.83,8.89 5V_POWER.I 63.12,8.71 68.99,8.71 71.65,6.04 77.17,6.04 D101.C 83.74,12.62 88.9,12.62 3V_POWER.I 89.08,12.98 92.99,16.89 92.99,53.16 R102.2 92.81,53.34 92.81,57.07 D105.C
  Bottom 0.7: C104.2 58.5,27.91 64.54,27.91 70.76,21.69 70.76,20.8 80.01,11.56 82.5,11.56 D101.C
RXI  (via drill 0.61)
  Top 0.406: v22.76,51.74 21.34,51.74 17.78,55.3 17.78,56.54 18.49,57.25 19.74,57.25 25.96,63.48 26.67,63.48 TEENSY.25 | v27.2,45.52 33.25,45.52 33.6,45.87 60.1,45.87 65.25,51.03 73.97,51.03 76.81,48.18 79.3,48.18 83.92,52.81 83.92,53.87 82.14,55.65 81.79,55.65 81.08,56.36 81.08,57.78 86.23,62.94 86.59,62.94 87.83,64.19 U$5.2
  Bottom 0.406: v22.76,51.74 22.76,49.96 v27.2,45.52
TXO
  Top 0.406: R103.2 66.5,53.34 59.74,46.58 26.31,46.58 24.18,44.45 8.89,44.45 7.47,45.87 7.47,48.01 10.13,50.67 10.13,56.36 11.02,57.25 17.25,57.25 23.47,63.48 24,63.48 TEENSY.24
VCC  (via drill 0.61)
  Top 0.7: U6.J2.2 11.56,47.12 13.87,47.12 U6.J2.3 14.22,46.76 14.58,46.76 16,45.34 23.82,45.34 25.96,47.47 36.45,47.47 45.7,56.72 45.7,60.63 C103.2 45.87,60.98 66.5,60.98 73.79,68.28 77.34,68.28 78.59,69.52 X4.3.3V 78.77,69.7 80.37,68.1 86.23,68.1 89.26,65.08 89.26,64.9 89.79,64.36 U$5.1 | v84.45,30.76 83.39,30.76 82.86,31.29 DATALOGGER.JP1$4
  Bottom 0.7: 82.55,31.75 DATALOGGER.JP1$4 | U$5.1 89.97,64.19 89.97,54.05 91.39,52.63 91.39,41.78 84.63,35.03 84.63,30.94 v84.45,30.76 94.59,20.62 94.59,13.87 88.9,8.18 3V_POWER.O
VDD  (via drill 0.61)
  Top 0.7: TEENSY.VIN 3.73,71.12 3.73,70.05 2.49,68.81 2.49,9.96 5.87,6.58 12.45,6.58 13.87,5.16 C102.2 | X4.5V 76.28,69.88 76.63,69.88 78.23,71.48 84.63,71.48 91.21,64.9 91.21,57.96 91.03,57.78 91.03,43.2 91.92,42.32 91.92,20.98 89.97,19.02 76.45,19.02 72.72,15.29 D108.A 72.36,15.11 70.94,13.69 66.67,13.69 66.5,13.87 62.94,13.87 5V_POWER.O 62.76,13.69 59.92,10.85 56.36,10.85 52.27,6.76 v51.74,6.76
  Bottom 0.7: v51.74,6.76 20.09,6.76 18.49,5.16 14.05,5.16 C102.2
VUSB  (via drill 0.61)
  Top 0.7: v68.45,7.29 56.36,7.29 52.63,3.56 46.58,3.56 v37.34,12.8
  Top 0.813: BAT_CHARGER.CHARGER 15.24,20.32 15.24,20.24 DCINPUT.2
  Bottom 0.7: TEENSY.VUSB 6.22,68.45 6.22,60.27 2.49,56.54 2.49,28.27 8.71,22.05 10.85,22.05 13.87,19.02 DCINPUT.2 14.22,18.85 20.27,12.8 v37.34,12.8 | v68.45,7.29 68.45,7.47 72.36,11.38 D101.A

### Text on the board
tDocu: POINTCAST V2.0 | Thanks to Shuttleworth Foundation, Medcom and Safecast volunteers